# Altium schematic sheet MCU.SchDoc
size A
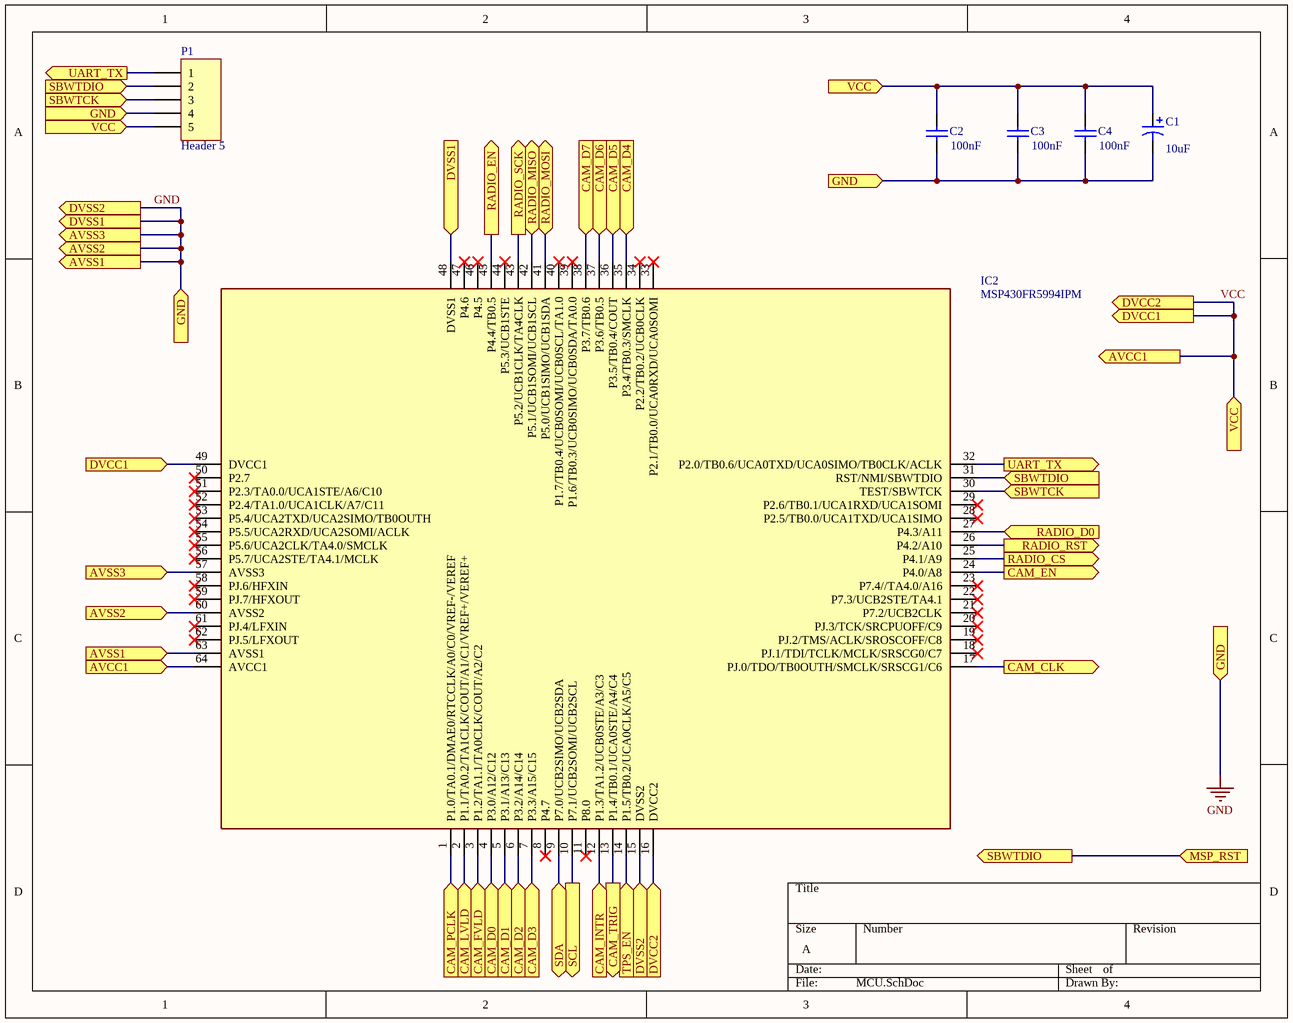
[diagram p0: MCU.SchDoc]

## Parts
C1  value 10uF  [C1210]
C2  value 100nF  [1608[0603]]  (hidden comment: Cap)
C3  value 100nF  [1608[0603]]  (hidden comment: Cap)
C4  value 100nF  [1608[0603]]  (hidden comment: Cap)
IC2  MSP430FR5994IPM  [QFP50P1200X1200X160-64N]
P1  Header 5  [MHDR1X5]

## Ports
AVCC1 (in), AVCC1 (out), AVSS1 (in), AVSS1 (out), AVSS2 (in), AVSS2 (out), AVSS3 (in), AVSS3 (out), CAM_CLK (out), CAM_D0 (in), CAM_D1 (in), CAM_D2 (in), CAM_D3 (in), CAM_D4 (in), CAM_D5 (in), CAM_D6 (in), CAM_D7 (in), CAM_EN (out), CAM_FVLD (in), CAM_INTR (in), CAM_LVLD (in), CAM_PCLK (in), CAM_TRIG (out), DVCC1 (in), DVCC1 (out), DVCC2 (in), DVCC2 (out), DVSS1 (in), DVSS1 (out), DVSS2 (in), DVSS2 (out), GND (in), MSP_RST (in), RADIO_CS (out), RADIO_D0 (in), RADIO_EN (out), RADIO_MISO (bidir), RADIO_MOSI (bidir), RADIO_RST (out), RADIO_SCK (out), SBWTCK (in), SBWTDIO (in), SBWTDIO (out), SCL (out), SDA (bidir), TPS_EN (in), UART_TX (out), VCC (in)

## Nets
GND: C1.2 C2.1 C3.1 C4.1 IC2.15(DVSS2) IC2.48(DVSS1) IC2.57(AVSS3) IC2.60(AVSS2) IC2.63(AVSS1) P1.4 ; port DVSS2, port AVSS1, port DVSS1, port AVSS2, port AVSS3, port GND
CAM_CLK: IC2.17(PJ.0/TDO/TB0OUTH/SMCLK/SRSCG1/C6) ; port CAM_CLK
CAM_D0: IC2.4(P3.0/A12/C12) ; port CAM_D0
CAM_D1: IC2.5(P3.1/A13/C13) ; port CAM_D1
CAM_D2: IC2.6(P3.2/A14/C14) ; port CAM_D2
CAM_D3: IC2.7(P3.3/A15/C15) ; port CAM_D3
CAM_D4: IC2.35(P3.4/TB0.3/SMCLK) ; port CAM_D4
CAM_D5: IC2.36(P3.5/TB0.4/COUT) ; port CAM_D5
CAM_D6: IC2.37(P3.6/TB0.5) ; port CAM_D6
CAM_D7: IC2.38(P3.7/TB0.6) ; port CAM_D7
CAM_EN: IC2.24(P4.0/A8) ; port CAM_EN
CAM_FVLD: IC2.3(P1.2/TA1.1/TA0CLK/COUT/A2/C2) ; port CAM_FVLD
CAM_INTR: IC2.12(P1.3/TA1.2/UCB0STE/A3/C3) ; port CAM_INTR
CAM_LVLD: IC2.2(P1.1/TA0.2/TA1CLK/COUT/A1/C1/VREF+/VEREF+) ; port CAM_LVLD
CAM_PCLK: IC2.1(P1.0/TA0.1/DMAE0/RTCCLK/A0/C0/VREF-/VEREF) ; port CAM_PCLK
CAM_TRIG: IC2.13(P1.4/TB0.1/UCA0STE/A4/C4) ; port CAM_TRIG
MSP_RST: IC2.31(RST/NMI/SBWTDIO) P1.2 ; port SBWTDIO, port MSP_RST
RADIO_CS: IC2.25(P4.1/A9) ; port RADIO_CS
RADIO_D0: IC2.27(P4.3/A11) ; port RADIO_D0
RADIO_EN: IC2.45(P4.4/TB0.5) ; port RADIO_EN
RADIO_MISO: IC2.42(P5.1/UCB1SOMI/UCB1SCL) ; port RADIO_MISO
RADIO_MOSI: IC2.41(P5.0/UCB1SIMO/UCB1SDA) ; port RADIO_MOSI
RADIO_RST: IC2.26(P4.2/A10) ; port RADIO_RST
RADIO_SCK: IC2.43(P5.2/UCB1CLK/TA4CLK) ; port RADIO_SCK
SBWTCK: IC2.30(TEST/SBWTCK) P1.3 ; port SBWTCK
SCL: IC2.10(P7.1/UCB2SOMI/UCB2SCL) ; port SCL
SDA: IC2.9(P7.0/UCB2SIMO/UCB2SDA) ; port SDA
TPS_EN: IC2.14(P1.5/TB0.2/UCA0CLK/A5/C5) ; port TPS_EN
UART_TX: IC2.32(P2.0/TB0.6/UCA0TXD/UCA0SIMO/TB0CLK/ACLK) P1.1 ; port UART_TX
VCC: C1.1 C2.2 C3.2 C4.2 IC2.16(DVCC2) IC2.49(DVCC1) IC2.64(AVCC1) P1.5 ; port DVCC2, port AVCC1, port DVCC1, port VCC

Not connected (* = marked no-connect by the designer): IC2 8(P4.7)* 11(P8.0)* 18(PJ.1/TDI/TCLK/MCLK/SRSCG0/C7)* 19(PJ.2/TMS/ACLK/SROSCOFF/C8)* 20(PJ.3/TCK/SRCPUOFF/C9)* 21(P7.2/UCB2CLK)* 22(P7.3/UCB2STE/TA4.1)* 23(P7.4//TA4.0/A16)* 28(P2.5/TB0.0/UCA1TXD/UCA1SIMO)* 29(P2.6/TB0.1/UCA1RXD/UCA1SOMI)* 33(P2.1/TB0.0/UCA0RXD/UCA0SOMI)* 34(P2.2/TB0.2/UCB0CLK)* 39(P1.6/TB0.3/UCB0SIMO/UCB0SDA/TA0.0)* 40(P1.7/TB0.4/UCB0SOMI/UCB0SCL/TA1.0)* 44(P5.3/UCB1STE)* 46(P4.5)* 47(P4.6)* 50(P2.7)* 51(P2.3/TA0.0/UCA1STE/A6/C10)* 52(P2.4/TA1.0/UCA1CLK/A7/C11)* 53(P5.4/UCA2TXD/UCA2SIMO/TB0OUTH)* 54(P5.5/UCA2RXD/UCA2SOMI/ACLK)* 55(P5.6/UCA2CLK/TA4.0/SMCLK)* 56(P5.7/UCA2STE/TA4.1/MCLK)* 58(PJ.6/HFXIN)* 59(PJ.7/HFXOUT)* 61(PJ.4/LFXIN)* 62(PJ.5/LFXOUT)*

## Library data of the parts
C1 = Cap Pol3: Polarized Capacitor (Surface Mount); Published: 8-Jun-2000; LatestRevisionDate: 29-May-2009; LatestRevisionNote: IPC-7351 Footprint Added.; PackageReference: C0805; Publisher: Altium Limited; PackageDescription: Chip Capacitor
C2-C4 = Cap: CAP CER 6.3V X5R/X7R 0603; PackageReference: 0603; Publisher: Altium Limited; PackageDescription: Chip Capacitor, Body 1.6x0.8mm, IPC High Density
IC2 = MSP430FR5994IPM: Integrated Circuit; Manufacturer_Name: Texas Instruments; Datasheet Link: http://www.ti.com/lit/gpn/msp430fr5994; Height: 1.6mm; Mouser Part Number: 595-MSP430FR5994IPM; Mouser Price/Stock: https://www.mouser.com/Search/Refine.aspx?Keyword=595-MSP430FR5994IPM; Manufacturer_Part_Number: MSP430FR5994IPM
P1 = Header 5: Header, 5-Pin; LatestRevisionDate: 17-Jul-2002; LatestRevisionNote: Re-released for DXP Platform.; Publisher: Altium Limited